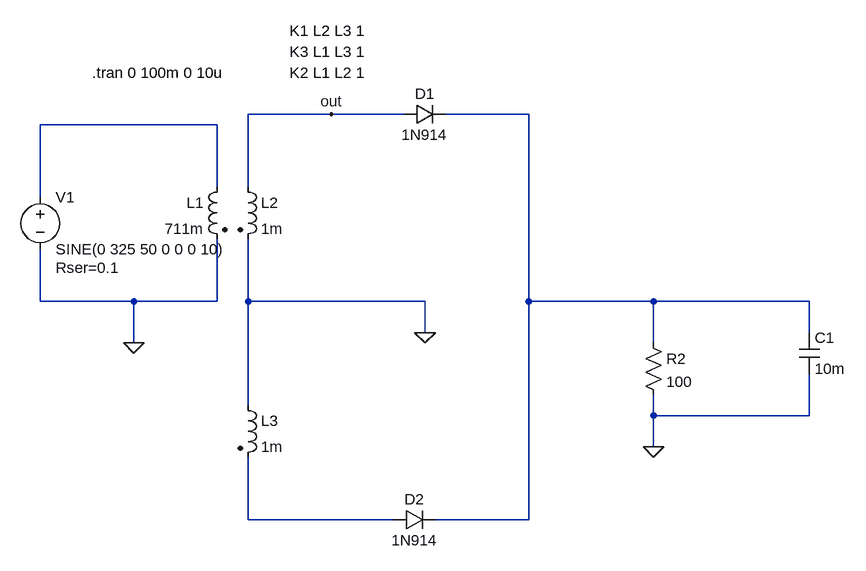
[diagram p0: schematic priklad3.1.asc]
priklad3.1.asc, the LTspice schematic file:
Version 4
SHEET 1 880 680
WIRE -352 -320 -480 -320
WIRE -240 -320 -352 -320
WIRE -48 -320 -176 -320
WIRE -528 -304 -800 -304
WIRE -528 -208 -528 -304
WIRE -480 -208 -480 -320
WIRE -800 -192 -800 -304
WIRE -800 -32 -800 -112
WIRE -656 -32 -800 -32
WIRE -528 -32 -528 -128
WIRE -528 -32 -656 -32
WIRE -480 -32 -480 -128
WIRE -208 -32 -480 -32
WIRE -48 -32 -48 -320
WIRE 144 -32 -48 -32
WIRE 384 -32 144 -32
WIRE -208 16 -208 -32
WIRE 384 16 384 -32
WIRE -656 32 -656 -32
WIRE 144 32 144 -32
WIRE -480 128 -480 -32
WIRE 144 144 144 112
WIRE 384 144 384 80
WIRE 384 144 144 144
WIRE 144 192 144 144
WIRE -480 304 -480 208
WIRE -256 304 -480 304
WIRE -48 304 -48 -32
WIRE -48 304 -192 304
FLAG -656 32 0
FLAG -208 16 0
FLAG -352 -320 out
FLAG 144 192 0
SYMBOL voltage -800 -208 R0
WINDOW 123 0 0 Left 2
WINDOW 39 24 124 Left 2
SYMATTR InstName V1
SYMATTR Value SINE(0 325 50 0 0 0 10)
SYMATTR SpiceLine Rser=0.1
SYMBOL diode -240 -304 R270
WINDOW 0 32 32 VTop 2
WINDOW 3 0 32 VBottom 2
SYMATTR InstName D1
SYMATTR Value 1N914
SYMBOL ind2 -512 -224 M0
SYMATTR InstName L1
SYMATTR Value 711m
SYMATTR Type ind
SYMBOL ind2 -496 -224 R0
SYMATTR InstName L2
SYMATTR Value 1m
SYMATTR Type ind
SYMBOL ind2 -496 112 R0
SYMATTR InstName L3
SYMATTR Value 1m
SYMATTR Type ind
SYMBOL diode -256 320 R270
WINDOW 0 32 32 VTop 2
WINDOW 3 0 32 VBottom 2
SYMATTR InstName D2
SYMATTR Value 1N914
SYMBOL res 128 16 R0
SYMATTR InstName R2
SYMATTR Value 100
SYMBOL cap 368 16 R0
SYMATTR InstName C1
SYMATTR Value 10m
TEXT -720 -384 Left 2 !.tran 0 100m 0 10u
TEXT -416 -384 Left 2 !K2 L1 L2 1
TEXT -416 -416 Left 2 !K3 L1 L3 1
TEXT -416 -448 Left 2 !K1 L2 L3 1

The netlist it stands for:
* priklad3.1.asc
V1 N002 0 SINE(0 325 50 0 0 0 10) Rser=0.1
D1 out N001 1N914
L1 N002 0 711m
L2 out 0 1m
L3 0 N003 1m
D2 N003 N001 1N914
R2 N001 0 100
C1 N001 0 10m
.model D D
.lib standard.dio
.tran 0 100m 0 10u
K2 L1 L2 1
K3 L1 L3 1
K1 L2 L3 1
.backanno
.end